# EAGLE design M707D (EAGLE 6.6.0)
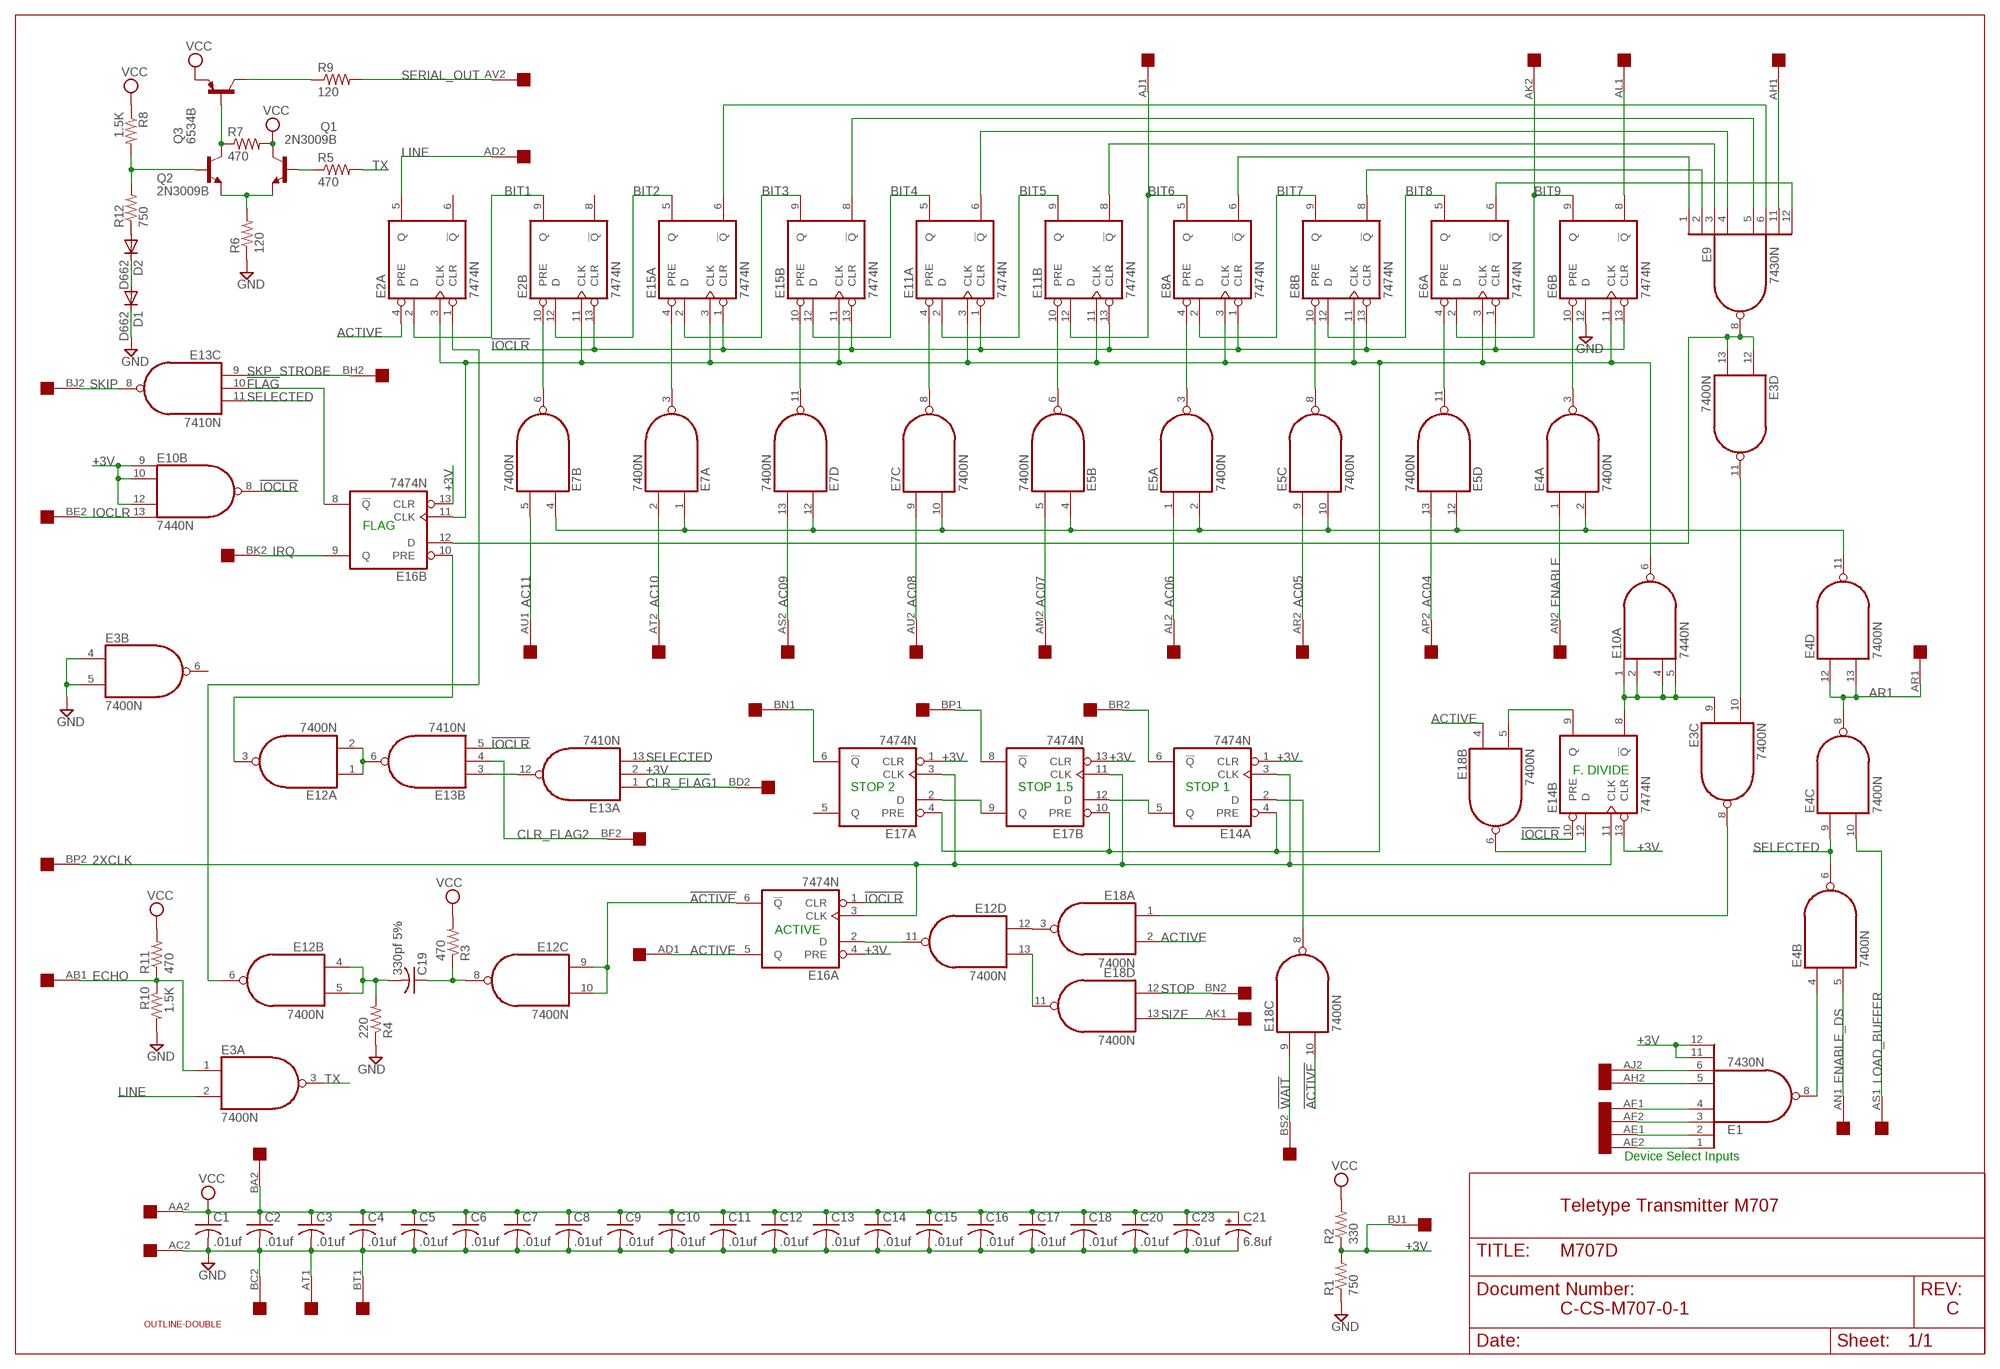
[diagram p0: schematic, sheet 1]

## Parts
C1  .01uf  C-US050-025X075  [C050-025X075]
C2  .01uf  C-US050-025X075  [C050-025X075]
C3  .01uf  C-US050-025X075  [C050-025X075]
C4  .01uf  C-US050-025X075  [C050-025X075]
C5  .01uf  C-US050-025X075  [C050-025X075]
C6  .01uf  C-US050-025X075  [C050-025X075]
C7  .01uf  C-US050-025X075  [C050-025X075]
C8  .01uf  C-US050-025X075  [C050-025X075]
C9  .01uf  C-US050-025X075  [C050-025X075]
C10  .01uf  C-US050-025X075  [C050-025X075]
C11  .01uf  C-US050-025X075  [C050-025X075]
C12  .01uf  C-US050-025X075  [C050-025X075]
C13  .01uf  C-US050-025X075  [C050-025X075]
C14  .01uf  C-US050-025X075  [C050-025X075]
C15  .01uf  C-US050-025X075  [C050-025X075]
C16  .01uf  C-US050-025X075  [C050-025X075]
C17  .01uf  C-US050-025X075  [C050-025X075]
C18  .01uf  C-US050-025X075  [C050-025X075]
C19  330pf 5%  C-US075-032X103  [C075-032X103]
C20  .01uf  C-US050-025X075  [C050-025X075]
C21  6.8uf  CPOL-USE15-5AXIAL  [E15-5]
C23  .01uf  C-US050-025X075  [C050-025X075]
D1  D662  1N4148DO35-10  [DO35-10]
D2  D662  1N4148DO35-10  [DO35-10]
E1  7430N  [DIL14]
E2  7474N  74S74N  [DIL14]
E3  7400N  [DIL14]
E4  7400N  [DIL14]
E5  7400N  [DIL14]
E6  7474N  74S74N  [DIL14]
E7  7400N  [DIL14]
E8  7474N  74S74N  [DIL14]
E9  7430N  [DIL14]
E10  7440N  74S20N  [DIL14]
E11  7474N  74S74N  [DIL14]
E12  7400N  [DIL14]
E13  7410N  [DIL14]
E14  7474N  74S74N  [DIL14]
E15  7474N  74S74N  [DIL14]
E16  7474N  74S74N  [DIL14]
E17  7474N  74S74N  [DIL14]
E18  7400N  [DIL14]
Q1  2N3009B  2N3440-NPN-TO39-EBC  [TO39]
Q2  2N3009B  2N3440-NPN-TO39-EBC  [TO39]
Q3  6534B  2N3637-PNP-TO39-EBC  [TO39]
R1  750  R-US_0207/10  [0207/10]
R2  330  R-US_0207/10  [0207/10]
R3  470  R-US_0207/10  [0207/10]
R4  220  R-US_0207/10  [0207/10]
R5  470  R-US_0207/10  [0207/10]
R6  120  R-US_0207/10  [0207/10]
R7  470  R-US_0207/10  [0207/10]
R8  1.5K  R-US_0207/10  [0207/10]
R9  120  R-US_0207/10  [0207/10]
R10  1.5K  R-US_0207/10  [0207/10]
R11  470  R-US_0207/10  [0207/10]
R12  750  R-US_0207/10  [0207/10]
U$1  OUTLINE-DOUBLE  [DOUBLE]
U$2  DOUBLE  [EDGE-CON4]

## Nets
2XCLK: E14.3(A:CLK) E14.11(B:CLK) E16.3(A:CLK) E17.3(A:CLK) E17.11(B:CLK) U$2.BP2
!ACTIVE: E12.9(C:I0) E12.10(C:I1) E16.6(A:!Q) E18.10(C:I1)
!FLAG: E13.10(C:I1) E16.8(B:!Q)
!IOCLR: E2.13(B:CLR) E6.1(A:CLR) E6.13(B:CLR) E8.1(A:CLR) E8.13(B:CLR) E10.8(B:O) E11.1(A:CLR) E11.13(B:CLR) E13.5(B:I2) E14.10(B:PRE) E15.1(A:CLR) E15.13(B:CLR) E16.1(A:CLR)
!WAIT: E18.9(C:I0) U$2.BS2
+3V: E1.11(I6) E1.12(I7) E10.9(B:I0) E10.10(B:I1) E10.12(B:I2) E13.2(A:I1) E14.1(A:CLR) E14.13(B:CLR) E16.4(A:PRE) E16.13(B:CLR) E17.1(A:CLR) E17.13(B:CLR) R1.2 R2.1 U$2.BJ1
AC04: E5.13(D:I1) U$2.AP2
AC05: E5.9(C:I0) U$2.AR2
AC06: E5.1(A:I0) U$2.AL2
AC07: E5.5(B:I1) U$2.AM2
AC08: E7.9(C:I0) U$2.AU2
AC09: E7.13(D:I1) U$2.AS2
AC10: E7.2(A:I1) U$2.AT2
AC11: E7.5(B:I1) U$2.AU1
ACTIVE: E2.4(A:PRE) E16.5(A:Q) E18.2(A:I1) E18.4(B:I0) U$2.AD1
AE1: E1.2(I1) U$2.AE1
AF1: E1.4(I3) U$2.AF1
AH1: E9.11(I6) U$2.AH1
AL1: E6.8(B:!Q) U$2.AL1
AR1: E4.8(C:O) E4.12(D:I0) E4.13(D:I1) U$2.AR1
BIT1: E2.2(A:D) E2.9(B:Q)
BIT2: E2.12(B:D) E15.5(A:Q)
BIT3: E15.2(A:D) E15.9(B:Q)
BIT4: E11.5(A:Q) E15.12(B:D)
BIT5: E11.2(A:D) E11.9(B:Q)
BIT6: E8.5(A:Q) E11.12(B:D) U$2.AJ1
BIT7: E8.2(A:D) E8.9(B:Q)
BIT8: E6.5(A:Q) E8.12(B:D)
BIT9: E6.2(A:D) E6.9(B:Q) U$2.AK2
BN1: E17.6(A:!Q) U$2.BN1
BP1: E17.8(B:!Q) U$2.BP1
CLR_FLAG1: E13.1(A:I0) U$2.BD2
CLR_FLAG2: E13.4(B:I1) U$2.BF2
ECHO: E3.1(A:I0) R10.1 R11.1 U$2.AB1
ENABLE: E4.1(A:I0) U$2.AN2
ENABLE_DS: E4.5(B:I1) U$2.AN1
GND [Supply]: C1.2 C2.2 C3.2 C4.2 C5.2 C6.2 C7.2 C8.2 C9.2 C10.2 C11.2 C12.2 C13.2 C14.2 C15.2 C16.2 C17.2 C18.2 C20.2 C21.- C23.2 D1.C E3.4(B:I0) E3.5(B:I1) E6.12(B:D) R1.1 R4.1 R6.1 R10.2 U$2.AC2 U$2.AT1 U$2.BC2 U$2.BT1
IOCLR: E10.13(B:I3) U$2.BE2
IRQ: E16.9(B:Q) U$2.BK2
LINE: E2.5(A:Q) E3.2(A:I1) U$2.AD2
LOAD_BUFFER: E4.10(C:I1) U$2.AS1
N$1: C19.1 E12.8(C:O) R3.1
N$2: C19.2 E12.4(B:I0) E12.5(B:I1) R4.2
N$3: E5.11(D:O) E6.4(A:PRE)
N$4: E2.1(A:CLR) E12.6(B:O)
N$5: E2.3(A:CLK) E2.11(B:CLK) E6.3(A:CLK) E6.11(B:CLK) E8.3(A:CLK) E8.11(B:CLK) E10.6(A:O) E11.3(A:CLK) E11.11(B:CLK) E14.4(A:PRE) E15.3(A:CLK) E15.11(B:CLK) E16.11(B:CLK) E17.4(A:PRE) E17.10(B:PRE)
N$6: E3.12(D:I0) E3.13(D:I1) E9.8(O) E16.12(B:D)
N$7: E6.6(A:!Q) E9.12(I7)
N$8: Q3.3(C) R9.1
N$9: E1.8(O) E4.4(B:I0)
N$10: E12.12(D:I0) E18.3(A:O)
N$11: E14.12(B:D) E18.6(B:O)
N$12: E1.6(I5) U$2.AJ2
N$13: E1.5(I4) U$2.AH2
N$15: E1.3(I2) U$2.AF2
N$16: E14.9(B:Q) E18.5(B:I1)
N$17: E1.1(I0) U$2.AE2
N$18: E9.6(I5) E15.6(A:!Q)
N$19: E4.2(A:I1) E4.11(D:O) E5.2(A:I1) E5.4(B:I0) E5.10(C:I1) E5.12(D:I0) E7.1(A:I0) E7.4(B:I0) E7.10(C:I1) E7.12(D:I0)
N$20: E4.3(A:O) E6.10(B:PRE)
N$22: D1.A D2.C
N$23: D2.A R12.1
N$24: Q1.2(B) R5.1
N$26: Q2.3(C) Q3.2(B) R7.1
N$27: Q1.1(E) Q2.1(E) R6.2
N$28: E12.11(D:O) E16.2(A:D)
N$30: Q2.2(B) R8.2 R12.2
N$35: E12.1(A:I0) E12.2(A:I1) E13.6(B:O)
N$36: E9.5(I4) E15.8(B:!Q)
N$37: E7.3(A:O) E15.4(A:PRE)
N$38: E3.9(C:I0) E10.1(A:I0) E10.2(A:I1) E10.4(A:I2) E10.5(A:I3) E14.8(B:!Q)
N$39: E3.8(C:O) E18.1(A:I0)
N$42: E7.8(C:O) E11.4(A:PRE)
N$49: E9.4(I3) E11.6(A:!Q)
N$52: E7.11(D:O) E15.10(B:PRE)
N$53: E5.3(A:O) E8.4(A:PRE)
N$54: E2.10(B:PRE) E7.6(B:O)
N$62: E12.13(D:I1) E18.11(D:O)
N$63: E14.6(A:!Q) U$2.BR2
N$132: E13.3(B:I0) E13.12(A:O)
N$138: E17.2(A:D) E17.9(B:Q)
N$142: E8.6(A:!Q) E9.1(I0)
N$152: E8.8(B:!Q) E9.2(I1)
N$153: E9.3(I2) E11.8(B:!Q)
N$161: E14.2(A:D) E18.8(C:O)
N$166: E14.5(A:Q) E17.12(B:D)
N$167: E12.3(A:O) E16.10(B:PRE)
N$378: E5.8(C:O) E8.10(B:PRE)
N$381: E5.6(B:O) E11.10(B:PRE)
N$460: E3.10(C:I1) E3.11(D:O)
SELECTED: E4.6(B:O) E4.9(C:I0) E13.11(C:I2) E13.13(A:I2)
SERIAL_OUT: R9.2 U$2.AV2
SIZE: E18.13(D:I1) U$2.AK1
SKIP: E13.8(C:O) U$2.BJ2
SKP_STROBE: E13.9(C:I0) U$2.BH2
STOP: E18.12(D:I0) U$2.BN2
TX: E3.3(A:O) R5.2
VCC [Supply]: C1.1 C2.1 C3.1 C4.1 C5.1 C6.1 C7.1 C8.1 C9.1 C10.1 C11.1 C12.1 C13.1 C14.1 C15.1 C16.1 C17.1 C18.1 C20.1 C21.+ C23.1 Q1.3(C) Q3.1(E) R2.2 R3.2 R7.2 R8.1 R11.2 U$2.AA2 U$2.BA2
Unconnected: E2.6(A:!Q) E2.8(B:!Q) E3.6(B:O) E17.5(A:Q) U$2.AA1 U$2.AB2 U$2.AC1 U$2.AM1 U$2.AP1 U$2.AV1 U$2.BA1 U$2.BB1 U$2.BB2 U$2.BC1 U$2.BD1 U$2.BE1 U$2.BF1 U$2.BH1 U$2.BK1 U$2.BL1 U$2.BL2 U$2.BM1 U$2.BM2 U$2.BR1 U$2.BS1 U$2.BT2 U$2.BU1 U$2.BU2 U$2.BV1 U$2.BV2

## Notes on the sheet
- FLAG
- F. DIVIDE
- STOP 2 | STOP 1.5 | STOP 1
- ACTIVE
- Device Select Inputs
- Teletype Transmitter M707
- C-CS-M707-0-1 | C

## Power pins joined to a net without a drawn wire
GND: E1.7(GND) E2.7(P:GND) E3.7(P:GND) E4.7(P:GND) E5.7(P:GND) E6.7(P:GND) E7.7(P:GND) E8.7(P:GND) E9.7(GND) E10.7(P:GND) E11.7(P:GND) E12.7(P:GND) E13.7(P:GND) E14.7(P:GND) E15.7(P:GND) E16.7(P:GND) E17.7(P:GND) E18.7(P:GND)
VCC: E1.14(VCC) E2.14(P:VCC) E3.14(P:VCC) E4.14(P:VCC) E5.14(P:VCC) E6.14(P:VCC) E7.14(P:VCC) E8.14(P:VCC) E9.14(VCC) E10.14(P:VCC) E11.14(P:VCC) E12.14(P:VCC) E13.14(P:VCC) E14.14(P:VCC) E15.14(P:VCC) E16.14(P:VCC) E17.14(P:VCC) E18.14(P:VCC)

## Library data of the parts
C1-C20 C23 = rcl:C-US: CAPACITOR, American symbol
C21 = rcl:CPOL-US: POLARIZED CAPACITOR, American symbol
D1 D2 = diode:1N4148: DIODE high speed (Philips)
E1 E9 = 74xx-us:74*30: 8-input NAND gate
E2 E6 E8 E11 E14-E17 = 74xx-us:74*74: Dual D type positive edge triggered FLIP FLOP, preset and clear
E3-E5 E7 E12 E18 = 74xx-us:74*00: Quad 2-input NAND gate
E10 = 74xx-us:74*20: Dual 4-input NAND gate
E13 = 74xx-us:74*10: Triple 3-input NAND gate
Q1 Q2 = transistor:*-NPN-: NPN Transistror BF959 corrected 2008.03.06
Q3 = transistor:*-PNP-: PNP Transistror
R1-R12 = rcl:R-US_: RESISTOR, American symbol
U$1 = dec-con:OUTLINE-*: Board outlines for DEC boards.
U$2 = dec-con:DOUBLE: Double-Height DEC board

## Net classes
1 Supply: width 0.813 mm

## Board
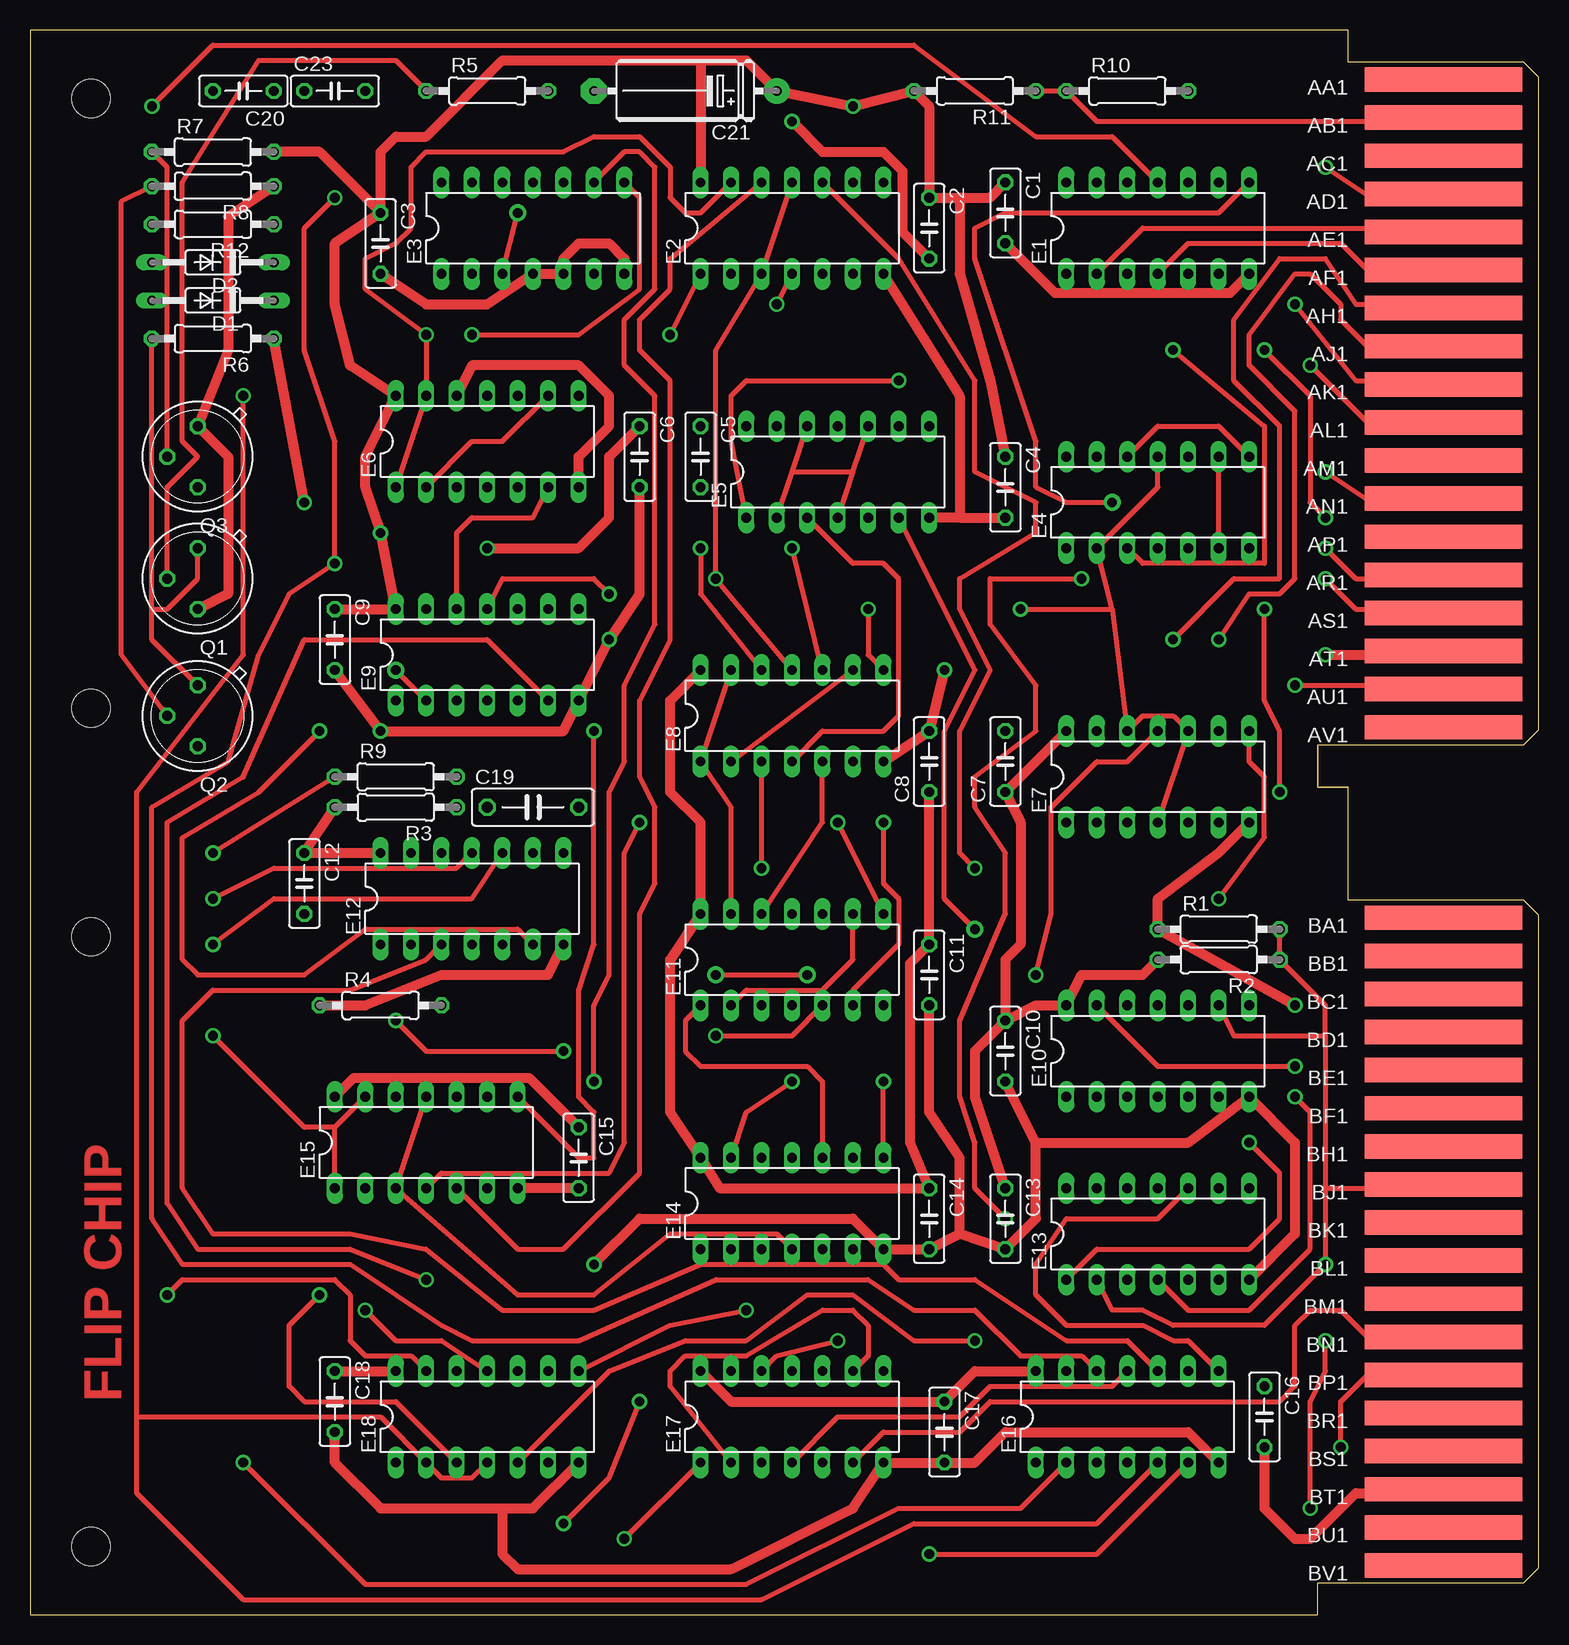
[diagram p1: board, top side]
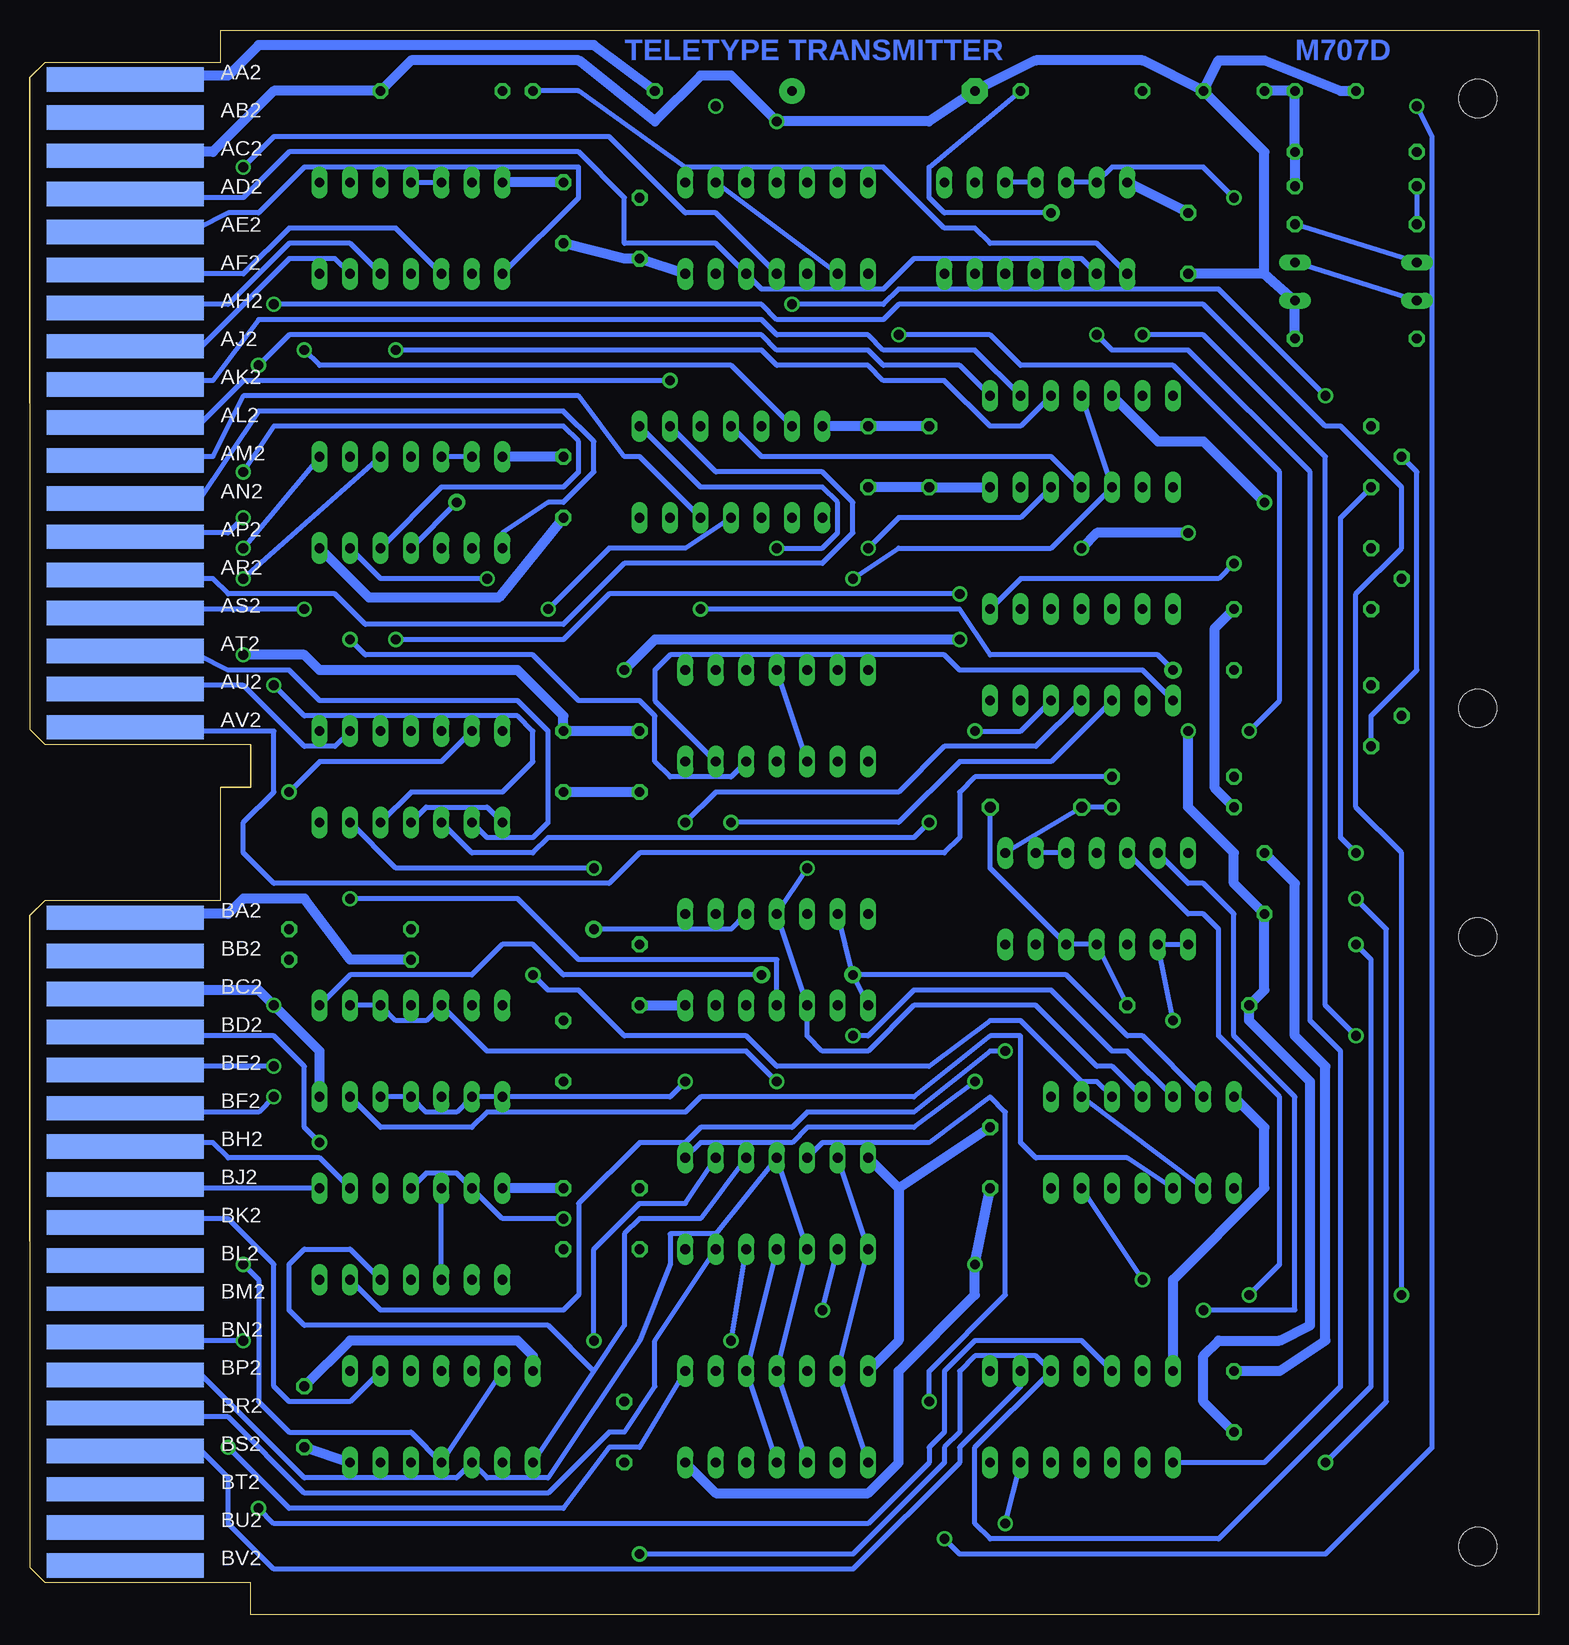
[diagram p2: board, bottom side, seen from below]

Size 125.73 x 132.08 mm. Coordinates in mm from the lower left corner, seen from the top.
Copper layers (1+16): Top 0.035mm / dielectric 1.5mm / Bottom 0.035mm
Design rules "16mils": minimum track width 16mil, minimum drill 32mil, track to track 15mil, track to pad 10mil, pad to pad 10mil, via to via 10mil, smd to smd 10mil, copper to edge 13mil, drill to drill 10mil, minimum pad ring 10mil, minimum via ring 8mil, stop-mask expansion 0mil, vias tented up to drill 0mil, thermal gap 10mil

### Footprints (pad centres in the part's own frame; a part is rotated, then mirrored left to right if it is on the bottom)
C050-025X075 = drill 0.813 octagon: 1 -2.54,0; 2 2.54,0
C075-032X103 = drill 0.914 octagon: 1 -3.81,0; 2 3.81,0
E15-5 = drill 0.813 pad 2.159: + -7.62,0 | drill 0.813 pad 2.159 octagon: - 7.62,0
DO35-10 = drill 0.813 long: A 5.08,0; C -5.08,0
DIL14 = drill 0.813 long: 1 -7.62,-3.81; 2 -5.08,-3.81; 3 -2.54,-3.81; 4 0,-3.81; 5 2.54,-3.81; 6 5.08,-3.81; 7 7.62,-3.81; 8 7.62,3.81; 9 5.08,3.81; 10 2.54,3.81; 11 0,3.81; 12 -2.54,3.81; 13 -5.08,3.81; 14 -7.62,3.81
TO39 = drill 0.813 octagon: 1 0,-2.54; 2 2.54,0; 3 0,2.54
0207/10 = drill 0.813 octagon: 1 -5.08,0; 2 5.08,0
DOUBLE = hole 3.175: 120.65,56.515; 120.65,5.715; 120.65,75.565; 120.65,126.365
EDGE-CON4 = smd 13.106 x 2.032: AA1 7.938,4.128; AB1 7.938,7.303; AC1 7.938,10.477; AD1 7.938,13.652; AE1 7.938,16.828; AF1 7.938,20.003; AH1 7.938,23.177; AJ1 7.938,26.352; AK1 7.938,29.527; AL1 7.938,32.703; AM1 7.938,35.877; AN1 7.938,39.053; AP1 7.938,42.227; AR1 7.938,45.403; AS1 7.938,48.578; AT1 7.938,51.752; AU1 7.938,54.928; AV1 7.938,58.102; BA1 7.938,73.978; BB1 7.938,77.153; BC1 7.938,80.328; BD1 7.938,83.502; BE1 7.938,86.677; BF1 7.938,89.853; BH1 7.938,93.028; BJ1 7.938,96.203; BK1 7.938,99.377; BL1 7.938,102.552; BM1 7.938,105.728; BN1 7.938,108.903; BP1 7.938,112.078; BR1 7.938,115.252; BS1 7.938,118.427; BT1 7.938,121.603; BU1 7.938,124.778; BV1 7.938,127.953 | smd 13.106 x 2.032 bottom: AA2 7.938,4.128; AB2 7.938,7.303; AC2 7.938,10.477; AD2 7.938,13.652; AE2 7.938,16.828; AF2 7.938,20.003; AH2 7.938,23.177; AJ2 7.938,26.352; AK2 7.938,29.527; AL2 7.938,32.703; AM2 7.938,35.877; AN2 7.938,39.053; AP2 7.938,42.227; AR2 7.938,45.403; AS2 7.938,48.578; AT2 7.938,51.752; AU2 7.938,54.928; AV2 7.938,58.102; BA2 7.938,73.978; BB2 7.938,77.153; BC2 7.938,80.328; BD2 7.938,83.502; BE2 7.938,86.677; BF2 7.938,89.853; BH2 7.938,93.028; BJ2 7.938,96.203; BK2 7.938,99.377; BL2 7.938,102.552; BM2 7.938,105.728; BN2 7.938,108.903; BP2 7.938,112.078; BR2 7.938,115.252; BS2 7.938,118.427; BT2 7.938,121.603; BU2 7.938,124.778; BV2 7.938,127.953

### Placement (x,y rotation side)
C1  81.28,116.84 270 top
C2  74.93,115.57 270 top
C3  29.21,114.3 270 top
C4  81.28,93.98 270 top
C5  55.88,96.52 270 top
C6  50.8,96.52 270 top
C7  81.28,71.12 90 top
C8  74.93,71.12 90 top
C9  25.4,81.28 270 top
C10  81.28,46.99 270 top
C11  74.93,53.34 270 top
C12  22.86,60.96 270 top
C13  81.28,33.02 270 top
C14  74.93,33.02 270 top
C15  45.72,38.1 270 top
C16  102.87,16.51 270 top
C17  76.2,15.24 270 top
C18  25.4,17.78 270 top
C19  41.91,67.31 0 top
C20  17.78,127 180 top
C21  54.61,127 180 top
C23  25.4,127 0 top
D1  15.24,109.54 180 top
D2  15.24,112.71 180 top
E1  93.98,115.57 0 top
E2  63.5,115.57 0 top
E3  41.91,115.57 0 top
E4  93.98,92.71 0 top
E5  67.31,95.25 0 top
E6  38.1,97.79 0 top
E7  93.98,69.85 0 top
E8  63.5,74.93 0 top
E9  38.1,80.01 0 top
E10  93.98,46.99 0 top
E11  63.5,54.61 0 top
E12  36.83,59.69 0 top
E13  93.98,31.75 0 top
E14  63.5,34.29 0 top
E15  33.02,39.37 0 top
E16  91.44,16.51 0 top
E17  63.5,16.51 0 top
E18  38.1,16.51 0 top
Q1  13.97,86.36 180 top
Q2  13.97,74.93 180 top
Q3  13.97,96.52 180 top
R1  99.06,57.15 0 top
R2  99.06,54.61 180 top
R3  30.48,67.31 180 top
R4  29.21,50.8 0 top
R5  38.1,127 0 top
R6  15.24,106.36 180 top
R7  15.24,121.92 0 top
R8  15.24,119.06 180 top
R9  30.48,69.85 0 top
R10  91.44,127 0 top
R11  78.74,127 180 top
R12  15.24,115.89 180 top
U$1  125.73,132.08 180 top
U$2  125.73,132.08 180 top

### Tracks (layer width: path | path; a pad name or v marks a point on that pad's centre or on a via)
2XCLK
  Bottom 0.406: E17.3 E17.11 E14.3 E14.11 68.58,31.75 72.39,31.75 72.39,29.21 74.93,22.86 82.55,11.43 87.63,11.43 E16.3 90.17,11.43 102.87,11.43 111.76,20.32 114.3,20.32 U$2.BP2
!ACTIVE  (via drill 0.81 pad 1.27)
  Top 0.406: E16.6 88.9,5.08 v74.93,5.08 | v15.24,55.88 20.32,59.69 36.83,59.69 E12.10
  Bottom 0.406: v74.93,5.08 57.15,5.08 49.53,12.7 49.53,13.97 48.26,15.24 48.26,20.32 46.99,21.59 41.91,21.59 E18.10 46.99,13.97 46.99,7.62 45.72,6.35 26.67,6.35 13.97,19.05 13.97,54.61 v15.24,55.88 | E12.10 E12.9
!FLAG
  Top 0.406: E16.8 96.52,22.86 95.25,22.86 92.71,24.13 86.36,24.13 83.82,26.67 83.82,29.21 86.36,33.02 93.98,33.02 E13.10
!IOCLR  (via drill 0.81 pad 1.27, 0.81 pad 1.42)
  Top 0.406: E11.1 54.61,49.53 54.61,46.99 55.88,45.72 64.77,45.72 66.04,44.45 E14.10 | E2.13 55.88,116.84 54.61,116.84 53.34,118.11 53.34,120.65 50.8,123.19 46.99,123.19 44.45,121.92 33.02,121.92 31.75,120.65 31.75,115.57 30.48,114.3 27.94,113.03 27.94,110.49 v33.02,106.68 E6.13 E6.1 | E11.13 58.42,67.31 E8.1 E8.13 | v15.24,48.26 22.86,40.64 25.4,40.64 | 25.4,40.64 E15.13 | E15.1 25.4,40.64 | v57.15,53.34 v64.77,53.34
  Bottom 0.406: v33.02,106.68 27.94,106.68 17.78,96.52 17.78,50.8 v15.24,48.26 | E13.5 99.06,30.48 102.87,30.48 104.14,29.21 104.14,25.4 102.87,24.13 82.55,24.13 78.74,20.32 | E14.10 69.85,33.02 74.93,33.02 76.2,31.75 76.2,24.13 78.74,20.32 | 78.74,20.32 E16.1 | E15.13 33.02,48.26 34.29,48.26 39.37,53.34 v57.15,53.34 | v57.15,53.34 E11.13 | v57.15,53.34 E11.1 | E10.8 99.06,53.34 88.9,53.34 86.36,55.88 83.82,55.88 81.28,53.34 v64.77,53.34
!WAIT
  Bottom 0.406: U$2.BS2 111.76,13.97 109.22,11.43 109.22,7.62 105.41,3.81 57.15,3.81 48.26,12.7 48.26,13.97 43.18,19.05 E18.9
+3V  (via drill 0.81 pad 1.27)
  Top 0.406: R1.2 R2.1 107.95,50.8 107.95,48.26 | v10.16,125.73 15.24,130.81 73.66,130.81 83.82,123.19 90.17,123.19 E1.11 | v49.53,6.35 E17.1 | E14.13 59.69,41.91 v63.5,44.45 | E13.2 90.17,25.4 92.71,25.4 95.25,24.13 102.87,24.13 v107.95,29.21 107.95,35.56 | 107.95,48.26 107.95,35.56 | 107.95,48.26 100.33,48.26 E10.9 | U$2.BJ1 113.03,35.56 107.95,35.56
  Bottom 0.406: E16.13 E16.4 93.98,15.24 104.14,15.24 106.68,17.78 106.68,27.94 v107.95,29.21 | E17.1 E17.13 E14.1 E14.13 | E10.9 E10.10 95.25,49.53 92.71,49.53 E10.12 87.63,46.99 66.04,46.99 v63.5,44.45 | E1.11 E1.12 | v49.53,6.35 48.26,5.08 17.78,5.08 8.89,13.97 8.89,123.19 v10.16,125.73
AC04  (via drill 0.81 pad 1.27)
  Top 0.406: v102.87,105.41 106.68,101.6 106.68,92.71 v107.95,91.44
  Bottom 0.406: U$2.AP2 111.76,90.17 109.22,90.17 v107.95,91.44 | v102.87,105.41 101.6,104.14 67.31,104.14 E5.13
AC05
  Bottom 0.406: E5.9 68.58,95.25 59.69,95.25 57.15,92.71 57.15,90.17 59.69,87.63 76.2,87.63 81.28,82.55 97.79,82.55 100.33,85.09 109.22,85.09 110.49,86.36 111.76,86.36 U$2.AR2
AC06  (via drill 0.81 pad 1.27)
  Top 0.406: v72.39,102.87 59.69,102.87 58.42,101.6 58.42,97.79 E5.1
  Bottom 0.406: U$2.AL2 111.76,99.06 107.95,102.87 73.66,102.87 v72.39,102.87
AC07
  Bottom 0.406: U$2.AM2 111.76,96.52 110.49,96.52 107.95,101.6 80.01,101.6 76.2,96.52 74.93,96.52 E5.5
AC08
  Bottom 0.406: U$2.AU2 113.39,77.11 113.03,77.47 107.95,77.47 102.87,72.39 100.33,72.39 E7.9
AC09  (via drill 0.81 pad 1.27)
  Top 0.406: v104.14,68.58 104.14,73.66 102.87,76.2 v102.87,83.82
  Bottom 0.406: E7.13 91.44,71.12 101.6,71.12 v104.14,68.58 | U$2.AS2 111.76,83.82 v102.87,83.82
AC10
  Bottom 0.406: E7.2 87.63,64.77 83.82,64.77 82.55,66.04 82.55,73.66 85.09,76.2 101.6,76.2 104.14,78.74 109.22,78.74 111.76,80.01 U$2.AT2
AC11  (via drill 0.81 pad 1.27)
  Top 0.406: U$2.AU1 111.76,77.47 v105.41,77.47
  Bottom 0.406: E7.5 93.98,68.58 86.36,68.58 83.82,71.12 83.82,73.66 85.09,74.93 102.87,74.93 v105.41,77.47
ACTIVE  (via drill 0.81 pad 1.27)
  Top 0.406: E16.5 88.9,7.62 73.66,7.62 60.96,1.27 17.78,1.27 8.89,10.16 8.89,16.51 | 8.89,16.51 29.21,16.51 E18.2 34.29,11.43 36.83,11.43 E18.4 | 8.89,16.51 8.89,68.58 17.78,80.01 v17.78,101.6 | U$2.AD1 111.76,118.11 v107.95,120.65 | v62.23,109.22 E2.4
  Bottom 0.406: v107.95,120.65 105.41,123.19 77.47,123.19 71.12,116.84 68.58,116.84 E2.4 | v17.78,101.6 26.67,110.49 53.34,110.49 54.61,109.22 v62.23,109.22
AE1
  Top 0.406: U$2.AE1 111.76,115.57 92.71,115.57 E1.2
AF1
  Top 0.406: U$2.AF1 111.76,111.76 109.22,114.3 96.52,114.3 E1.4
AH1  (via drill 0.81 pad 1.27)
  Top 0.406: E9.11 39.37,86.36 46.99,86.36 v48.26,85.09 | U$2.AH1 111.76,109.22 110.49,109.22 107.95,113.03 104.14,113.03 100.33,107.95 100.33,102.87 104.14,99.06 104.14,86.36 100.33,86.36 v95.25,81.28
  Bottom 0.406: v48.26,85.09 77.47,85.09 81.28,81.28 v95.25,81.28
AL1  (via drill 0.81 pad 1.27)
  Top 0.406: U$2.AL1 111.76,99.06 v106.68,104.14
  Bottom 0.406: v106.68,104.14 104.14,106.68 64.77,106.68 63.5,105.41 55.88,105.41 54.61,104.14 48.26,104.14 E6.8
AR1  (via drill 0.81 pad 1.27)
  Top 0.406: U$2.AR1 111.76,86.36 110.49,86.36 v107.95,88.9 | E4.12 93.98,99.06 99.06,99.06 E4.8
  Bottom 0.406: E4.13 E4.12 | E4.8 v107.95,88.9
BIT1
  Bottom 0.406: E2.2 E2.9
BIT2
  Top 0.406: E15.5 40.64,30.48 44.45,30.48 50.8,36.83 50.8,58.42 52.07,60.96 52.07,67.31 50.8,69.85 50.8,76.2 53.34,81.28 53.34,102.87 50.8,105.41 50.8,107.95 53.34,110.49 53.34,113.03 E2.12
BIT3
  Bottom 0.406: E15.2 E15.9
BIT4  (via drill 0.81 pad 1.27)
  Top 0.406: E11.5 63.5,48.26 v57.15,48.26
  Bottom 0.406: E15.12 34.29,46.99 35.56,46.99 40.64,52.07 52.07,52.07 55.88,48.26 v57.15,48.26
BIT5
  Top 0.406: E11.2 59.69,52.07 66.04,52.07 68.58,54.61 E11.9
BIT6  (via drill 0.81 pad 1.27)
  Top 0.406: U$2.AJ1 111.76,105.41 109.22,107.95 109.22,109.22 106.68,111.76 105.41,111.76 101.6,106.68 101.6,104.14 105.41,100.33 105.41,86.36 104.14,85.09 101.6,85.09 v99.06,81.28 | E11.12 66.04,66.04 E8.5
  Bottom 0.406: v99.06,81.28 97.79,80.01 83.82,80.01 80.01,76.2 74.93,76.2 73.66,74.93 73.66,71.12 72.39,69.85 67.31,69.85 E8.5
BIT7
  Top 0.406: E8.2 E8.9
BIT8  (via drill 0.81 pad 1.27)
  Top 0.406: E8.12 55.88,85.09 v55.88,88.9
  Bottom 0.406: E6.5 43.18,91.44 53.34,91.44 v55.88,88.9
BIT9
  Top 0.406: E6.2 36.83,97.79 39.37,97.79 E6.9
  Bottom 0.406: U$2.AK2 111.76,102.87 110.49,102.87 106.68,107.95 64.77,107.95 63.5,106.68 55.88,106.68 54.61,105.41 46.99,105.41 E6.9
BN1
  Top 0.406: U$2.BN1 111.76,22.86 109.22,25.4 106.68,25.4 105.41,24.13 105.41,19.05 104.14,17.78 80.01,17.78 77.47,15.24 71.12,15.24 E17.6
BP1  (via drill 0.81 pad 1.27)
  Top 0.406: U$2.BP1 111.76,20.32 109.22,17.78 v109.22,13.97
  Bottom 0.406: v109.22,13.97 104.14,8.89 81.28,8.89 77.47,13.97 74.93,13.97 E17.8
CLR_FLAG1  (via drill 0.81 pad 1.27)
  Top 0.406: E13.1 88.9,30.48 101.6,30.48 104.14,33.02 104.14,36.83 v101.6,39.37
  Bottom 0.406: U$2.BD2 111.76,48.26 105.41,48.26 102.87,45.72 102.87,40.64 v101.6,39.37
CLR_FLAG2  (via drill 0.81 pad 1.27)
  Top 0.406: E13.4 96.52,25.4 101.6,25.4 106.68,30.48 106.68,41.91 v105.41,43.18
  Bottom 0.406: U$2.BF2 113.03,41.91 106.68,41.91 v105.41,43.18
ECHO
  Top 0.406: U$2.AB1 111.76,124.77 111.76,124.46 88.9,124.46 R10.1 R11.1
  Bottom 0.406: E3.1 36.83,114.3 45.72,114.3 46.99,115.57 49.53,115.57 54.61,120.65 71.12,120.65 80.01,127 R11.1
ENABLE
  Bottom 0.406: U$2.AN2 111.76,92.71 106.68,100.33 81.28,100.33 78.74,97.79 78.74,95.25 81.28,92.71 82.55,92.71 86.36,90.17 E4.1
ENABLE_DS  (via drill 0.81 pad 1.27)
  Top 0.406: U$2.AN1 111.76,92.71 v107.95,95.25
  Bottom 0.406: v107.95,95.25 105.41,99.06 81.28,99.06 80.01,97.79 80.01,95.25 81.28,93.98 91.44,93.98 E4.5
GND  (via drill 0.81 pad 1.27)
  Top 0.813: E1.7 100.01,110.17 85.41,110.17 C1.2 | C2.2 72.71,115.25 72.71,120.33 71.12,121.92 66.04,121.92 v63.5,124.46 | C18.2 25.4,12.7 29.21,8.89 39.37,8.89 | 39.37,8.89 41.91,8.89 E18.7 | 39.37,8.89 39.37,5.08 40.64,3.81 58.42,3.81 68.58,8.89 E17.7 C17.2 78.74,12.7 81.28,15.24 96.52,15.24 E16.7 | U$2.BT1 116.84,10.16 110.49,10.16 106.68,6.35 105.41,6.35 102.87,8.89 C16.2 | C11.2 74.93,41.91 77.47,38.1 77.47,31.75 | 77.47,31.75 C14.2 E14.7 68.58,33.02 50.8,33.02 v46.99,29.21 | 77.47,31.75 C13.2 83.82,33.02 83.82,39.37 | E13.7 105.41,31.75 105.41,39.37 E10.7 96.52,39.37 83.82,39.37 | 83.82,39.37 C10.2 | C9.2 v29.21,73.66 44.45,73.66 E9.7 v48.26,81.28 50.8,85.09 C6.2 | E12.7 43.18,53.34 34.29,53.34 27.94,50.8 R4.1 | C3.2 33.02,109.22 38.1,109.22 E3.4 E3.5 44.45,113.03 45.72,114.3 48.26,114.3 49.53,113.03 E3.7 | E6.12 36.83,104.14 45.72,104.14 48.26,101.6 48.26,99.06 45.72,96.52 E6.7 | E7.7 99.06,63.5 93.98,59.69 R1.1 v105.41,50.8 | E8.7 C8.2 v76.2,78.74 | U$2.AT1 111.76,80.01 v107.95,80.01 | 77.47,91.44 C4.2 | 77.47,91.44 E5.7 | 77.47,91.44 77.47,101.6 E2.7 | v22.86,92.71 R6.1 | C15.2 E15.7
  Bottom 0.813: E16.7 C16.2 | 22.86,111.76 D1.C R6.1 | 22.86,111.76 C3.2 | C20.2 16.51,127 22.86,129.54 26.67,129.54 C23.2 | C23.2 22.86,121.92 22.86,111.76 | C8.2 C7.2 81.28,74.93 85.09,78.74 86.36,78.74 101.6,78.74 102.87,80.01 v107.95,80.01 | E2.7 C2.2 76.2,113.03 C1.2 | U$2.BC2 111.76,52.07 106.68,52.07 v105.41,50.8 101.6,46.99 E10.7 | U$2.AC2 111.76,121.92 110.49,121.92 105.41,127 R10.2 93.98,129.54 80.01,129.54 73.66,124.46 69.85,128.27 67.31,128.27 v63.5,124.46 50.8,124.46 C21.- 41.91,129.54 33.02,129.54 C23.2 | E4.7 97.47,84.77 86.68,84.77 C4.2 | v22.86,92.71 27.94,97.79 31.75,97.79 E6.12 | C5.2 C6.2 E6.7 | v76.2,78.74 73.66,81.28 v48.26,81.28 | C18.2 27.94,17.78 27.94,21.59 26.67,22.86 21.59,22.86 19.05,24.13 19.05,44.45 24.13,49.53 R4.1 22.86,52.07 C12.2 25.4,60.96 25.4,63.5 29.21,67.31 v29.21,73.66 | E17.7 68.58,10.16 55.88,10.16 53.34,12.7 53.34,20.32 46.99,26.67 v46.99,29.21 C15.2 | C11.2 E11.7
IOCLR  (via drill 0.81 pad 1.27)
  Top 0.406: v105.41,45.72 93.98,45.72 E10.13
  Bottom 0.406: U$2.BE2 111.76,45.72 v105.41,45.72
IRQ
  Bottom 0.406: E16.9 99.06,17.78 104.14,17.78 105.41,19.05 105.41,29.21 109.22,33.02 113.03,33.02 U$2.BK2
LINE
  Bottom 0.406: E3.2 38.1,113.03 52.07,113.03 54.61,110.49 64.77,110.49 E2.5 68.58,114.3 76.2,114.3 76.2,118.11 80.01,121.92 104.14,121.92 107.95,118.11 111.76,118.11 U$2.AD2
LOAD_BUFFER  (via drill 0.81 pad 1.27)
  Top 0.406: U$2.AS1 111.76,83.82 110.49,83.82 v107.95,86.36
  Bottom 0.406: E4.10 v107.95,86.36
N$1
  Bottom 0.406: R3.1 C19.1 E12.8
N$2
  Bottom 0.406: R4.2 E12.4 E12.5 45.72,62.23 C19.2
N$3
  Bottom 0.406: E6.4 40.64,96.52 64.77,96.52 E5.11
N$4  (via drill 0.81 pad 1.27)
  Top 0.406: v53.34,106.68 E2.1 | v24.13,73.66 19.05,68.58 12.7,64.77 12.7,54.61 13.97,53.34 22.86,53.34 27.94,57.15 40.64,57.15 E12.6
  Bottom 0.406: v53.34,106.68 45.72,106.68 43.18,104.14 30.48,104.14 21.59,95.25 21.59,76.2 v24.13,73.66
N$5  (via drill 0.81 pad 1.27)
  Top 0.406: E14.4 62.23,31.75 53.34,31.75 46.99,26.67 40.64,26.67 E15.3 E15.11 | v60.96,62.23 E8.3 | E8.11 v57.15,86.36 57.15,105.41 E2.3 E2.11 | E17.4 67.31,16.51 77.47,16.51 80.01,19.05 90.17,19.05 E16.11
  Bottom 0.406: E17.4 E17.10 E14.4 | v60.96,62.23 E11.11 E11.3 60.96,48.26 59.69,46.99 55.88,46.99 52.07,50.8 41.91,50.8 36.83,45.72 35.56,45.72 E15.11 | E6.11 E6.3 40.64,88.9 53.34,88.9 v57.15,86.36 | E8.3 E8.11 | E10.6 96.52,40.64 88.9,40.64 87.63,41.91 71.12,41.91 69.85,43.18 52.07,43.18 45.72,48.26 43.18,48.26 43.18,39.37 41.91,38.1 34.29,38.1 E15.3
N$6  (via drill 0.81 pad 1.27)
  Top 0.406: E16.12 87.63,21.59 82.55,21.59 78.74,25.4 73.66,25.4 69.85,27.94 57.15,27.94 45.72,22.86 36.83,22.86 34.29,24.13 26.67,29.21 12.7,29.21 10.16,33.02 10.16,67.31 16.51,71.12 19.05,80.01 21.59,85.09 v25.4,87.63 25.4,97.79 22.86,105.41 22.86,115.57 v25.4,118.11
  Bottom 0.406: v25.4,118.11 27.94,120.65 35.56,120.65 E3.13 E3.12 | E9.8 43.18,86.36 26.67,86.36 v25.4,87.63
N$7
  Top 0.406: E9.12 35.56,90.17 36.83,91.44 41.91,91.44 E6.6
N$8  (via drill 0.81 pad 1.27)
  Top 0.406: v15.24,63.5 R9.1
  Bottom 0.406: v15.24,63.5 16.51,64.77 16.51,91.44 Q3.3
N$9  (via drill 0.81 pad 1.42)
  Top 0.406: E1.8 99.06,116.84 81.28,116.84 78.74,115.57 78.74,113.03 83.82,97.79 83.82,93.98 86.36,92.71 v90.17,92.71
  Bottom 0.406: v90.17,92.71 E4.4
N$10  (via drill 0.81 pad 1.27)
  Top 0.406: v24.13,26.67 21.59,24.13 21.59,19.05 22.86,17.78 30.48,17.78 E18.3
  Bottom 0.406: E12.12 29.21,58.42 27.94,58.42 26.67,57.15 26.67,48.26 21.59,43.18 21.59,29.21 v24.13,26.67
N$11  (via drill 0.81 pad 1.27)
  Top 0.406: v44.45,7.62 48.26,11.43 v50.8,17.78
  Bottom 0.406: v44.45,7.62 E18.6 | E14.12 59.69,39.37 50.8,39.37 45.72,43.18 44.45,41.91 44.45,26.67 50.8,20.32 v50.8,17.78
N$12
  Bottom 0.406: U$2.AJ2 111.76,105.41 104.14,113.03 100.33,113.03 E1.6
N$13
  Bottom 0.406: E1.5 99.06,114.3 104.14,114.3 109.22,109.22 113.03,109.22 U$2.AH2
N$15
  Bottom 0.406: E1.3 95.25,115.57 104.14,115.57 107.95,111.76 111.76,111.76 U$2.AF2
N$16  (via drill 0.81 pad 1.27)
  Top 0.406: v78.74,22.86 73.66,22.86 68.58,26.67 64.77,26.67 59.69,22.86 54.61,22.86 48.26,20.32 E18.5
  Bottom 0.406: E14.9 71.12,34.29 74.93,34.29 78.74,30.48 v78.74,22.86
N$17
  Bottom 0.406: U$2.AE2 111.76,115.57 109.22,116.84 106.68,116.84 102.87,120.65 80.01,120.65 80.01,118.11 E1.1
N$18  (via drill 0.81 pad 1.27)
  Top 0.406: v33.02,27.94 26.67,30.48 13.97,30.48 11.43,34.29 11.43,66.04 17.78,69.85 22.86,81.28 38.1,81.28 E9.6
  Bottom 0.406: v33.02,27.94 E15.6
N$19  (via drill 0.81 pad 1.27)
  Top 0.406: 90.17,83.82 E7.12 92.71,74.93 95.25,74.93 E7.10 E7.4 | 90.17,83.82 E4.2 93.98,93.98 E4.11 | v82.55,83.82 90.17,83.82 | E5.2 63.5,95.25 | 63.5,95.25 E5.12 | 68.58,95.25 E5.4 | 68.58,95.25 E5.10 | 63.5,95.25 68.58,95.25
  Bottom 0.406: E7.1 87.63,67.31 92.71,67.31 E7.4 | v82.55,83.82 77.47,88.9 71.12,88.9 E5.4
N$20  (via drill 0.81 pad 1.27)
  Top 0.406: E4.3 92.71,87.63 102.87,87.63 102.87,99.06 v95.25,105.41
  Bottom 0.406: E6.10 43.18,99.06 45.72,99.06 49.53,102.87 54.61,102.87 55.88,104.14 63.5,104.14 64.77,105.41 v95.25,105.41
N$22
  Bottom 0.406: D1.A D2.C
N$23
  Bottom 0.406: D2.A R12.1
N$24
  Top 0.406: Q1.2 11.43,93.98 13.97,96.52 12.7,97.79 12.7,119.38 19.05,129.54 30.48,129.54 R5.1
N$26
  Top 0.406: R7.1 11.43,120.65 Q3.2
  Bottom 0.406: Q2.3 13.97,74.93 10.16,78.74 10.16,95.25 Q3.2
N$27
  Top 0.406: Q2.1 10.16,81.28 10.16,83.82 | 10.16,83.82 R6.2 | Q1.1 13.97,86.36 11.43,83.82 10.16,83.82
N$28  (via drill 0.81 pad 1.27)
  Top 0.406: v15.24,59.69 20.32,62.23 35.56,62.23 E12.11 | E16.2 82.55,8.89 72.39,8.89 59.69,2.54 27.94,2.54 v17.78,12.7
  Bottom 0.406: v17.78,12.7 12.7,17.78 12.7,57.15 v15.24,59.69
N$30
  Top 0.406: Q2.2 7.62,80.01 7.62,117.79 R8.2
  Bottom 0.406: R8.2 R12.2
N$35  (via drill 0.81 pad 1.27)
  Top 0.406: v30.48,49.53 33.02,46.99 v44.45,46.99
  Bottom 0.406: E12.1 E12.2 v30.48,49.53 | v44.45,46.99 45.72,46.99 52.07,41.91 60.96,41.91 62.23,40.64 69.85,40.64 71.12,39.37 74.93,39.37 80.01,34.29 80.01,26.67 81.28,25.4 96.52,25.4 E13.6
N$36  (via drill 0.81 pad 1.27)
  Top 0.406: E15.8 45.72,38.1 46.99,38.1 46.99,41.91 45.72,43.18 45.72,52.07 46.99,55.88 v46.99,73.66
  Bottom 0.406: v46.99,73.66 43.18,73.66 E9.5
N$37  (via drill 0.81 pad 1.27)
  Top 0.406: E15.4 34.29,36.83 48.26,36.83 49.53,39.37 49.53,63.5 v50.8,66.04
  Bottom 0.406: E7.3 88.9,63.5 83.82,63.5 82.55,64.77 52.07,64.77 v50.8,66.04
N$38  (via drill 0.81 pad 1.27)
  Top 0.406: v46.99,44.45 46.99,50.8 48.26,53.34 48.26,68.58 49.53,71.12 49.53,77.47 52.07,82.55 52.07,101.6 49.53,104.14 49.53,107.95 52.07,110.49 52.07,120.65 50.8,121.92 49.53,121.92 E3.9 | E14.8 v71.12,44.45
  Bottom 0.406: E10.5 E10.4 92.71,41.91 90.17,41.91 E10.2 E10.1 72.39,43.18 v71.12,44.45 | v46.99,44.45 52.07,40.64 60.96,40.64 62.23,39.37 69.85,39.37 E14.8
N$39  (via drill 0.81 pad 1.27)
  Top 0.406: v36.83,106.68 45.72,106.68 50.8,110.49 50.8,118.11 E3.8
  Bottom 0.406: v36.83,106.68 35.56,105.41 29.21,105.41 19.05,95.25 19.05,49.53 16.51,46.99 16.51,19.05 22.86,12.7 E18.1
N$42  (via drill 0.81 pad 1.27)
  Top 0.406: v99.06,59.69 102.87,64.77 102.87,69.85 101.6,71.12 E7.8
  Bottom 0.406: E11.4 63.5,54.61 80.01,54.61 85.09,59.69 v99.06,59.69
N$49  (via drill 0.81 pad 1.27)
  Top 0.406: v71.12,66.04 71.12,60.96 72.39,59.69 72.39,55.88 68.58,52.07 E11.6
  Bottom 0.406: E9.4 41.91,72.39 49.53,72.39 53.34,68.58 68.58,68.58 v71.12,66.04
N$52  (via drill 0.81 pad 1.27)
  Top 0.406: v83.82,53.34 85.09,58.42 85.09,67.31 88.9,71.12 91.44,71.12 E7.11
  Bottom 0.406: E15.10 36.83,44.45 38.1,44.45 43.18,49.53 45.72,49.53 50.8,45.72 63.5,45.72 66.04,48.26 76.2,48.26 80.01,52.07 82.55,52.07 v83.82,53.34
N$53
  Top 0.406: E5.3 68.58,87.63 71.12,87.63 72.39,86.36 72.39,74.93 71.12,73.66 66.04,73.66 E8.4
N$54  (via drill 0.81 pad 1.27)
  Top 0.406: v78.74,62.23 77.47,63.5 77.47,73.66 80.01,78.74 77.47,83.82 77.47,86.36 83.82,90.17 83.82,92.71 78.74,95.25 78.74,102.87 72.39,113.03 E2.10
  Bottom 0.406: v78.74,62.23 95.25,62.23 E7.6
N$62  (via drill 0.81 pad 1.27)
  Top 0.406: E18.11 34.29,22.86 30.48,22.86 v27.94,25.4
  Bottom 0.406: E12.13 29.21,60.96 27.94,60.96 25.4,58.42 25.4,48.26 20.32,43.18 20.32,25.4 v27.94,25.4
N$63
  Bottom 0.406: U$2.BR2 111.76,16.51 109.22,16.51 102.87,10.16 82.55,10.16 77.47,15.24 76.2,15.24 73.66,19.05 73.66,22.86 E14.6
N$132
  Bottom 0.406: E13.3 E13.12
N$138
  Top 0.406: E17.9 69.85,21.59 69.85,24.13 68.58,25.4 66.04,25.4 59.69,21.59 54.61,21.59 53.34,20.32 53.34,19.05 E17.2
N$142
  Bottom 0.406: E9.1 33.02,78.74 48.26,78.74 49.53,80.01 72.39,80.01 73.66,78.74 73.66,76.2 E8.6
N$152  (via drill 0.81 pad 1.27, 0.81 pad 1.42)
  Top 0.406: E8.8 69.85,80.01 v69.85,83.82 | E9.2 v30.48,78.74
  Bottom 0.406: v69.85,83.82 48.26,83.82 45.72,80.01 31.75,80.01 v30.48,78.74
N$153  (via drill 0.81 pad 1.27)
  Top 0.406: v67.31,66.04 E11.8
  Bottom 0.406: E9.3 40.64,71.12 48.26,71.12 53.34,66.04 v67.31,66.04
N$161  (via drill 0.81 pad 1.27)
  Top 0.406: E18.8 53.34,24.13 v59.69,25.4
  Bottom 0.406: v59.69,25.4 E14.2
N$166  (via drill 0.81 pad 1.27)
  Top 0.406: E17.12 62.23,21.59 v67.31,22.86
  Bottom 0.406: v67.31,22.86 E14.5
N$167
  Top 0.406: E16.10 91.44,22.86 86.36,22.86 78.74,27.94 72.39,27.94 71.12,29.21 55.88,29.21 46.99,25.4 39.37,25.4 33.02,30.48 26.67,31.75 15.24,31.75 12.7,35.56 12.7,49.53 15.24,52.07 26.67,52.07 33.02,54.61 E12.3
N$378  (via drill 0.81 pad 1.27)
  Top 0.406: E8.10 v63.5,88.9
  Bottom 0.406: E5.8 69.85,93.98 59.69,93.98 58.42,92.71 58.42,90.17 59.69,88.9 v63.5,88.9
N$381  (via drill 0.81 pad 1.42)
  Top 0.406: E5.6 78.74,78.74 76.2,73.66 76.2,59.69 v78.74,57.15
  Bottom 0.406: E11.10 67.31,57.15 v78.74,57.15
N$460
  Bottom 0.406: E3.11 E3.10
SELECTED  (via drill 0.81 pad 1.27)
  Top 0.406: v81.28,33.02 78.74,35.56 78.74,39.37 77.47,43.18 77.47,49.53 81.28,58.42 81.28,63.5 78.74,67.31 78.74,69.85 83.82,73.66 83.82,77.47 80.01,82.55 80.01,86.36 v87.63,86.36 | E4.6 E4.9
  Bottom 0.406: E13.11 92.71,36.83 90.17,36.83 E13.13 86.36,33.02 v81.28,33.02 | v87.63,86.36 96.52,86.36 E4.6
SERIAL_OUT
  Bottom 0.406: U$2.AV2 114.3,73.66 105.41,73.66 105.41,68.58 107.95,66.04 107.95,63.5 105.41,60.96 77.47,60.96 74.93,63.5 49.53,63.5 48.26,64.77 48.26,68.58 46.99,69.85 R9.2
SIZE  (via drill 0.81 pad 1.27)
  Top 0.406: E18.13 31.75,21.59 27.94,21.59 26.67,22.86 26.67,26.67 25.4,27.94 12.7,27.94 v11.43,26.67 | U$2.AK1 111.76,102.87 110.49,102.87 v105.41,109.22
  Bottom 0.406: v11.43,26.67 11.43,63.5 15.24,67.31 15.24,85.09 11.43,88.9 11.43,93.98 16.51,99.06 17.78,99.06 27.94,109.22 53.34,109.22 54.61,107.95 63.5,107.95 64.77,109.22 v105.41,109.22
SKIP
  Bottom 0.406: U$2.BJ2 112.09,35.89 111.76,35.56 E13.8
SKP_STROBE
  Bottom 0.406: U$2.BH2 112.09,39.04 111.76,39.37 110.49,39.37 109.22,38.1 101.6,38.1 E13.9
STOP  (via drill 0.81 pad 1.27)
  Top 0.406: v106.68,8.89 106.68,17.78 107.95,20.32 v107.95,22.86
  Bottom 0.406: U$2.BN2 111.76,22.86 v107.95,22.86 | E18.12 38.1,22.86 46.99,22.86 49.53,20.32 49.53,15.24 50.8,13.97 50.8,12.7 55.88,7.62 105.41,7.62 v106.68,8.89
TX  (via drill 0.81 pad 1.42)
  Top 0.406: E3.3 v40.64,116.84
  Bottom 0.406: R5.2 50.8,120.65 50.8,118.11 49.53,116.84 v40.64,116.84
VCC  (via drill 0.81 pad 1.27)
  Top 0.813: R8.1 16.51,116.52 16.51,105.41 Q3.1 16.51,96.52 16.51,85.09 Q1.3 | R7.2 24.13,121.92 C3.1 | C3.1 29.21,121.92 30.48,123.19 33.02,123.19 39.37,129.54 55.88,129.54 | 55.88,129.54 59.69,129.54 C21.+ v68.58,125.73 R11.2 74.93,125.73 C2.1 77.47,118.11 | 77.47,118.11 80.01,118.11 C1.1 | C18.1 E18.14 | E16.14 78.74,20.32 C17.1 58.42,17.78 E17.14 | C9.1 E9.14 v29.21,90.17 27.94,93.98 27.94,96.52 E6.14 26.67,104.14 25.4,109.22 25.4,114.3 C3.1 | E15.14 26.99,44.77 41.59,44.77 C15.1 | E12.14 C12.1 R3.2 | C6.1 48.26,96.52 48.26,91.44 45.72,88.9 v38.1,88.9 | C13.1 78.74,43.18 78.74,46.99 C10.1 | C8.1 C11.1 73.34,54.29 73.34,39.37 C14.1 57.47,35.56 E14.14 53.34,41.91 53.34,54.61 E11.14 55.88,66.04 53.34,68.58 53.34,76.2 E8.14 | C10.1 83.82,50.8 E10.14 87.63,53.34 92.71,53.34 R2.2 | C10.1 81.28,54.61 82.55,55.88 82.55,66.04 C7.1 E7.14 | C4.1 80.01,102.87 77.47,111.76 77.47,118.11 | 55.88,129.54 E2.14
  Bottom 0.813: C16.1 99.06,22.86 85.09,22.86 83.82,21.59 E16.14 | R8.1 R7.2 C20.1 C23.1 | C8.1 C7.1 | U$2.BA2 111.76,58.42 109.22,58.42 107.95,59.69 102.87,59.69 99.06,54.61 R2.2 | U$2.AA2 111.76,128.27 109.22,128.27 106.68,130.81 78.74,130.81 R11.2 | C1.1 E1.14 | C3.1 E3.14 | v38.1,88.9 36.83,90.17 v29.21,90.17 | C6.1 C5.1 E5.14 | R3.2 26.99,68.9 26.99,82.23 C9.1 | C4.1 E4.14 | C18.1 21.59,20.32 17.78,22.86 17.78,45.72 20.32,48.26 20.32,60.96 C12.1 | E17.14 53.34,22.86 53.34,35.56 | 53.34,35.56 E14.14 | C13.1 E13.14 | C15.1 53.34,35.56 | E18.14 30.48,27.94 22.86,35.56 22.86,40.64 E15.14

### Text on the board
Top: FLIP CHIP
Bottom: M707D | TELETYPE TRANSMITTER
200bmp: C:/Users/Vince/Documents/websvn/trunk/Eagle/projects/DEC/Mxxx/M707/M707Dfront.bmp